# Altium schematic sheet ZEROCROSS.SchDoc
size A3; SheetNumber: 5; SheetTotal: 9
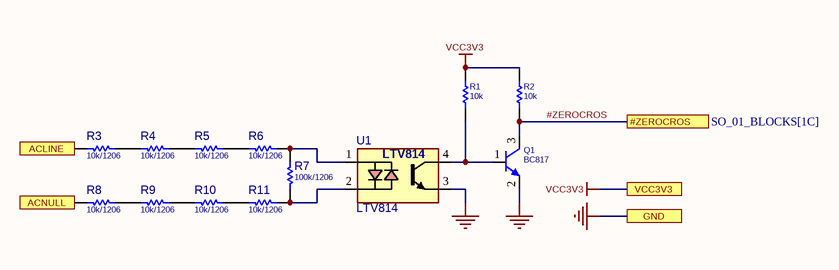
[diagram p0: ZEROCROSS.SchDoc]

## Parts
Q1  BC817  [SOT23_3]
R1  10k  [R0603]
R2  10k  [R0603]
R3  10k/1206  [R1206]
R4  10k/1206  [R1206]
R5  10k/1206  [R1206]
R6  10k/1206  [R1206]
R7  100k/1206  [R1206]
R8  10k/1206  [R1206]
R9  10k/1206  [R1206]
R10  10k/1206  [R1206]
R11  10k/1206  [R1206]
U1  LTV814  [DIP_4SMD]

## Ports
#ZEROCROS (see SO_01_BLOCKS[1C]), ACLINE, ACNULL, GND, VCC3V3

## Nets
GND: Q1.2(E) U1.3(E) ; port GND
VCC3V3: R1.2 R2.2 ; port VCC3V3
#ZEROCROS: Q1.3(C) R2.1 ; port #ZEROCROS
ACLINE: R3.2 ; port ACLINE
ACNULL: R8.2 ; port ACNULL
NetQ1_1: Q1.1(B) R1.1 U1.4(C)
NetR3_1: R3.1 R4.2
NetR4_1: R4.1 R5.2
NetR5_1: R5.1 R6.2
NetR6_1: R6.1 R7.1 U1.1(A)
NetR7_2: R7.2 R11.1 U1.2(K)
NetR8_1: R8.1 R9.2
NetR9_1: R9.1 R10.2
NetR10_1: R10.1 R11.2

## Library data of the parts
Q1 = NPN_BC817_SOT23: BJT, NPN, 45v, 0.5A, SMD, SOT23; PARAM: 0.5A, Hfe100~600; PARAM2: 45v, 250mW; MANF: NXP, ON; MANF_P#: BC817; VALUE: BC817
R1 R2 = RES_SMD_0603: RESISTOR, SMD; PARAM: -W; DESC: DESCRIPTION; DIST#: MOUSER; PARAM2: 1%; MANF_P#: -; MANF: -; ASSEMBLY: ASSEMBLY; PRICE: 100= 0.5$
R3-R11 = RES_SMD_1206: RESISTOR, SMD, 1206; PARAM: -W; DESC: DESCRIPTION; DIST#: MOUSER; PARAM2: 1%; MANF_P#: -; MANF: -; ASSEMBLY: ASSEMBLY; PRICE: 100= 0.5$
  R3-R6 R8-R11: VALUE: 10k/1206
  R7: VALUE: 100k/1206
U1 = OPTC_TR4P_LTV814: AC inpiut .OPTOCOUPLER, TRANSISTOR, 4PIN; PARAM: IF= 1mA; PARAM2: VCE = 20V; MANF: SHARP; MANF_P#: LTV814; PRICE: -; VALUE: LTV814